# Altium project SonicMaximizer.PrjPcb
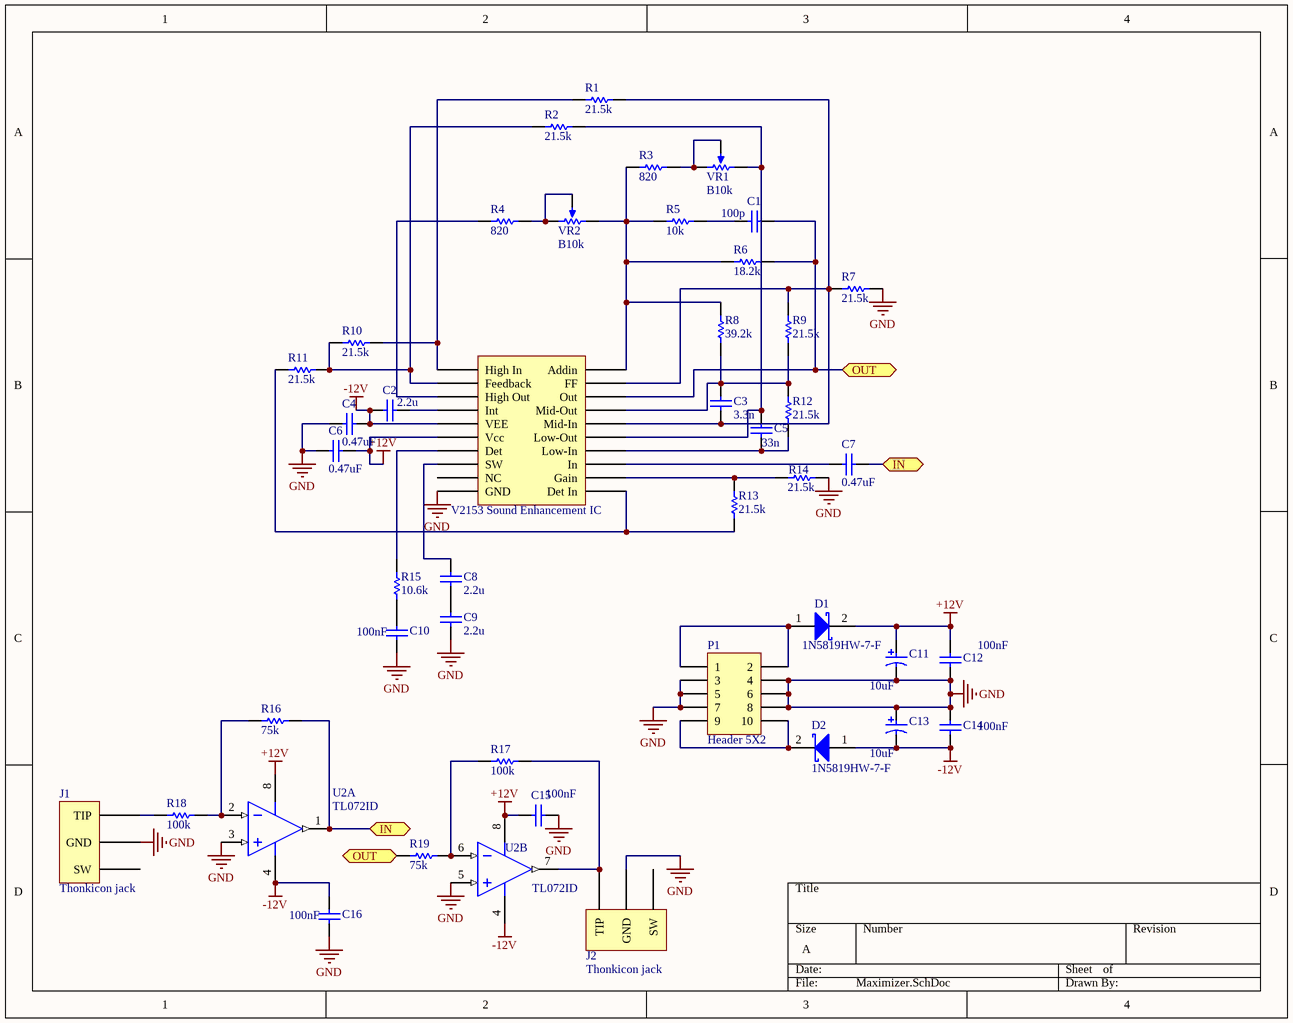
[diagram p0: Maximizer.SchDoc]
1 sheet, 44 parts. Net scope: flat (ports and power ports of the same name join across sheets).
Board files: SoundNicerPCB.PcbDoc, PanelCoordinate.PcbDoc

## Sheet Maximizer.SchDoc
size A

### Parts
C1  value 100p  [CAPC0603(1608)100_M]  (hidden comment: 100pF)
C2  value 2.2u  [CAPC0603(1608)100_M]  (hidden comment: 2.2uF)
C3  value 3.3n  [CAPC0603(1608)100_M]  (hidden comment: 3.3nF)
C4  0.47uF  [CAPC0603(1608)100_M]
C5  value 33n  [CAPC0603(1608)100_M]  (hidden comment: 33nF)
C6  0.47uF  [CAPC0603(1608)100_M]
C7  0.47uF  [CAPC0603(1608)100_M]
C8  value 2.2u  [CAPC0603(1608)100_M]  (hidden comment: 2.2uF)
C9  value 2.2u  [CAPC0603(1608)100_M]  (hidden comment: 2.2uF)
C10  100nF  [CAPC0603(1608)100_M]
C11  10uF  [NIC-CAPA2-4X5.8_V]
C12  100nF  [CAPC0603(1608)100_M]
C13  10uF  [NIC-CAPA2-4X5.8_V]
C14  100nF  [CAPC0603(1608)100_M]
C15  100nF  [CAPC0603(1608)100_M]
C16  100nF  [CAPC0603(1608)100_M]
D1  1N5819HW-7-F  [DIOD-SOD-123-2_V]
D2  1N5819HW-7-F  [DIOD-SOD-123-2_V]
J1  Thonkicon jack  [Thonkiconn Pot PJ301M]
J2  Thonkicon jack  [Thonkiconn Pot PJ301M]
P1  Header 5X2  [HDR2X5]
R1  21.5k  [RESC0603(1608)_M]
R2  21.5k  [RESC0603(1608)_M]
R3  820  [RESC0603(1608)_M]
R4  820  [RESC0603(1608)_M]
R5  10k  [RESC0603(1608)_M]
R6  18.2k  [RESC0603(1608)_M]
R7  21.5k  [RESC0603(1608)_M]
R8  39.2k  [RESC0603(1608)_M]
R9  21.5k  [RESC0603(1608)_M]
R10  21.5k  [RESC0603(1608)_M]
R11  21.5k  [RESC0603(1608)_M]
R12  21.5k  [RESC0603(1608)_M]
R13  21.5k  [RESC0603(1608)_M]
R14  21.5k  [RESC0603(1608)_M]
R15  10.6k  [RESC0603(1608)_M]
R16  75k  [RESC0603(1608)_M]
R17  100k  [RESC0603(1608)_M]
R18  100k  [RESC0603(1608)_M]
R19  75k  [RESC0603(1608)_M]
U1  V2153 Sound Enhancement IC  [SOIC20 - duplicate]
U2  TL072ID  [D0008A_N]  (parts A,B of 2)
VR1  B10k  [SonGueiPot]
VR2  B10k  [SonGueiPot]

### Ports
IN, OUT

### Nets
+12V: C6.2 C11.1 C12.1 C15.1 D1.2(K) U1.6(Vcc) U2.8(VCC+)
-12V: C2.1 C4.2 C13.2 C14.2 C16.1 D2.1(A) U1.5(VEE) U2.4(VCC-)
GND: C4.1 C6.1 C9.1 C10.2 C11.2 C12.2 C13.1 C14.1 C15.2 C16.2 J1.1(GND) J2.1(GND) P1.3 P1.4 P1.5 P1.6 P1.7 P1.8 R7.1 R14.1 U1.10(GND) U2.3(IN1+) U2.5(IN2+)
NetC1_1: C1.1 R5.1
NetC1_2: C1.2 R6.1 R19.2 U1.18(Out) ; port OUT
NetC2_2: C2.2 U1.4(Int)
NetC3_1: C3.1 R1.1 R7.2 R9.1 U1.16(Mid-In) U1.19(FF)
NetC3_2: C3.2 R8.1 R9.2 R12.1 U1.17(Mid-Out)
NetC5_1: C5.1 R12.2 U1.14(Low-In)
NetC5_2: C5.2 R2.1 U1.15(Low-Out) VR1.3(CW)
NetC7_1: C7.1 U1.13(In)
NetC7_2: C7.2 R16.1 U2.1(OUT1) ; port IN
NetC8_1: C8.1 C9.2
NetC8_2: C8.2 U1.8(SW)
NetC10_1: C10.1 R15.1
NetD1_1: D1.1(A) P1.1 P1.2
NetD2_2: D2.2(K) P1.9 P1.10
NetJ1_3: J1.3(TIP) R18.2
NetJ2_3: J2.3(TIP) R17.1 U2.7(OUT2)
NetR1_2: R1.2 R10.1 U1.1(High_In)
NetR2_2: R2.2 R10.2 R11.1 U1.2(Feedback)
NetR3_1: R3.1 VR1.1(CCW) VR1.2(WIPER)
NetR3_2: R3.2 R5.2 R6.2 R8.2 U1.20(Addin) VR2.3(CW)
NetR4_1: R4.1 VR2.1(CCW) VR2.2(WIPER)
NetR4_2: R4.2 U1.3(High_Out)
NetR11_2: R11.2 R13.2 U1.11(Det_In)
NetR13_1: R13.1 R14.2 U1.12(Gain)
NetR15_2: R15.2 U1.7(Det)
NetR16_2: R16.2 R18.1 U2.2(IN1-)
NetR17_2: R17.2 R19.1 U2.6(IN2-)

Not connected (* = marked no-connect by the designer): J1 2(SW); J2 2(SW); U1 9(NC)

### Library data of the parts
C1 = CMP-1035-00002-1: CAP; Mfr: AVX; Mfr_Pn: 06032A101JAT2A; Case-EIA: 0603; Tolderance: 10%; Distributor: Mouser; Distributor_Pn: 581-06032A101JAT2A
C2 C8 C9 = CMP-1035-00002-1: CAP; Mfr: Murata; Mfr_Pn: GRM188R61E225KA12D; Case-EIA: 0603; Tolderance: 10%; Distributor: Mouser; Distributor_Pn: 81-GRM188R61E225KA2D
C3 = CMP-1035-00002-1: CAP; Mfr: AVX; Mfr_Pn: 06035A332JAT2A; Case-EIA: 0603; Tolderance: 10%; Distributor: Mouser; Distributor_Pn: 581-06035A332JAT2A
C4 C6 C7 = CMP-1035-00002-1: CAP; Mfr: Murata; Mfr_Pn: GCM188R71E474KA64J; Distributor: Mouser; Distributor_Pn: 81-GCM188R71E474KA4J
C5 = CMP-1035-00002-1: CAP; Mfr: Murata; Mfr_Pn: GRM188R71H333KA61D; Case-EIA: 0603; Tolderance: 10%; Distributor: Mouser; Distributor_Pn: 81-GRM188R71H333KA61
C10 C12 C14-C16 = CMP-1035-00002-1: CAP; Mfr: AVX; Mfr_Pn: MM035C104KCZ2A; Distributor: Mouser; Distributor_Pn: 581-MM035C104KCZ2A
C11 C13 = CMP-0687-00016-1: Aluminum Electrolytic Capacitor, UD Series, Low Impedance, 10 uF, 25 V, + / - 20%, -55 to 105 degC, Chip Type, 4 x 5.8 mm D x L, Pb-Free, Reel; Mfr: Nichicon; Mfr_Pn: UUD1E100MCL1GS; Distributor: Mouser; Distributor_Pn: 647-UUD1E100MCL
D1 D2 = CMP-0303-00003-1: 1.0 A Surface Mount Schottky Barrier Rectifier, 40 V, -65 to 125 degC, 2-Pin SOD-123 Package, RoHS, Tape and Reel; Mfr: Diodes Inc.; Distributor: Mouser; Distributor_Pn: 621-1N5819HW-F; Mfr_Pn: 1N5819HW-7-F
P1 = Header 5X2: Header, 5-Pin, Dual row; Ditributor_Pn: 855-M20-9980545; LatestRevisionDate: 17-Jul-2002; LatestRevisionNote: Re-released for DXP Platform.; Publisher: Altium Limited
R1 R2 R7 R9-R14 = CMP-1012-00002-1: Res; Mfr: Susumu; Mfr_Pn: RG1608P-2152-D-T5; Case-EIA: 0603; Tolerance: 5 %; Value: 21.5k; Distributor: Mouser; Distributor_Pn: 754-RG1608P-2152DT5
R3 R4 = CMP-1012-00002-1: Res; Mfr: Susumu; Mfr_Pn: RR0816P-821-D; Case-EIA: 0603; Tolerance: 5 %; Value: 820; Distributor: Mouser; Distributor_Pn: 754-RR0816P-821D
R5 = CMP-1012-00002-1: Res; Mfr: Susumu; Mfr_Pn: RR0816P-103-D; Case-EIA: 0603; Tolerance: 5 %; Value: 10k; Distributor: Mouser; Distributor_Pn: 754-RR0816P-103D
R6 = CMP-1012-00002-1: Res; Mfr: Susumu; Mfr_Pn: RR0816P-1822-D-26C; Case-EIA: 0603; Tolerance: 5 %; Value: 18.2k; Distributor: Mouser; Distributor_Pn: 754-RR0816P-1822D26C
R8 = CMP-1012-00002-1: Res; Mfr: KOA; Mfr_Pn: RK73H1JTTD3922F; Case-EIA: 0603; Tolerance: 5 %; Value: 39.2k; Distributor: Mouser; Distributor_Pn: 660-RK73H1JTTD3922F
R15 = CMP-1012-00002-1: Res; Mfr: Koa; Mfr_Pn: RN73H1JTTD1062D100; Case-EIA: 0603; Tolerance: 5 %; Value: 10.6k; Distributor: Mouser; Distributor_Pn: 660-RN73H1JT1062D100
R16 R19 = CMP-1012-00002-1: Res; Mfr: Susumu; Mfr_Pn: RR0816P-753D; Case-EIA: 0603; Tolerance: 5 %; Value: 75k; Distributor: Mouser; Distributor_Pn: 754-RR0816P-753D
R17 R18 = CMP-1012-00002-1: Res; Mfr: Susumu; Mfr_Pn: RR0816P-104-D; Case-EIA: 0603; Tolerance: 5 %; Value: 100k; Distributor: Mouser; Distributor_Pn: 754-RR0816P-104D
U1 = CoolaudioV2153: V2153
U2 = CMP-0015-00077-2: Dual Low-Noise JFET-Input General-Purpose Operational Amplifier, 7 to 36 V, -40 to 85 degC, 8-pin SOIC (D8), Green (RoHS & no Sb/Br); Mfr: ST Micro; Mfr_Pn: TL072IDT; Distributor: Mouser; Distributor_Pn: 511-TL072IDT
VR1 VR2 = CMP-0972-00009-1: Trimming Potentiometer, 5K Ohm +/- 10%, -55 to 125 degC, 3-Pin 19.05 x 4.83 x 6.6 mm THD, Transparent Housing, RoHS; Manufacturer: Bourns; PartNumber: 3006P-7-502ZLF; Resistance (kOhm): 5; Resistance Tolerance: +/- 10%; Rotational Life: 200 Cycles; Number of Turns: 15; PackageDescription: 3-Pin THD, Body 19.05 x 4.83 mm, Height 6.6 mm; ComponentLink3Description: Package Specification; ComponentLink1URL: http://www.bourns.com/; PackageReference: 3006P-3; RoHS: TRUE; PackageVersion: Apr-14; Mounting Technology: Through Hole; ComponentLink3URL: http://www.bourns.com/data/global/pdfs/3006.pdf; ComponentLink1Description: Manufacturer URL; Temperature Range: -55 to 125 degC; DatasheetVersion: Apr-14; ComponentLink2Description: Datasheet; ComponentLink2URL: http://www.bourns.com/data/global/pdfs/3006.pdf